# EAGLE schematic GND_SATION_PCB_1.02 (EAGLE 9.6.2)
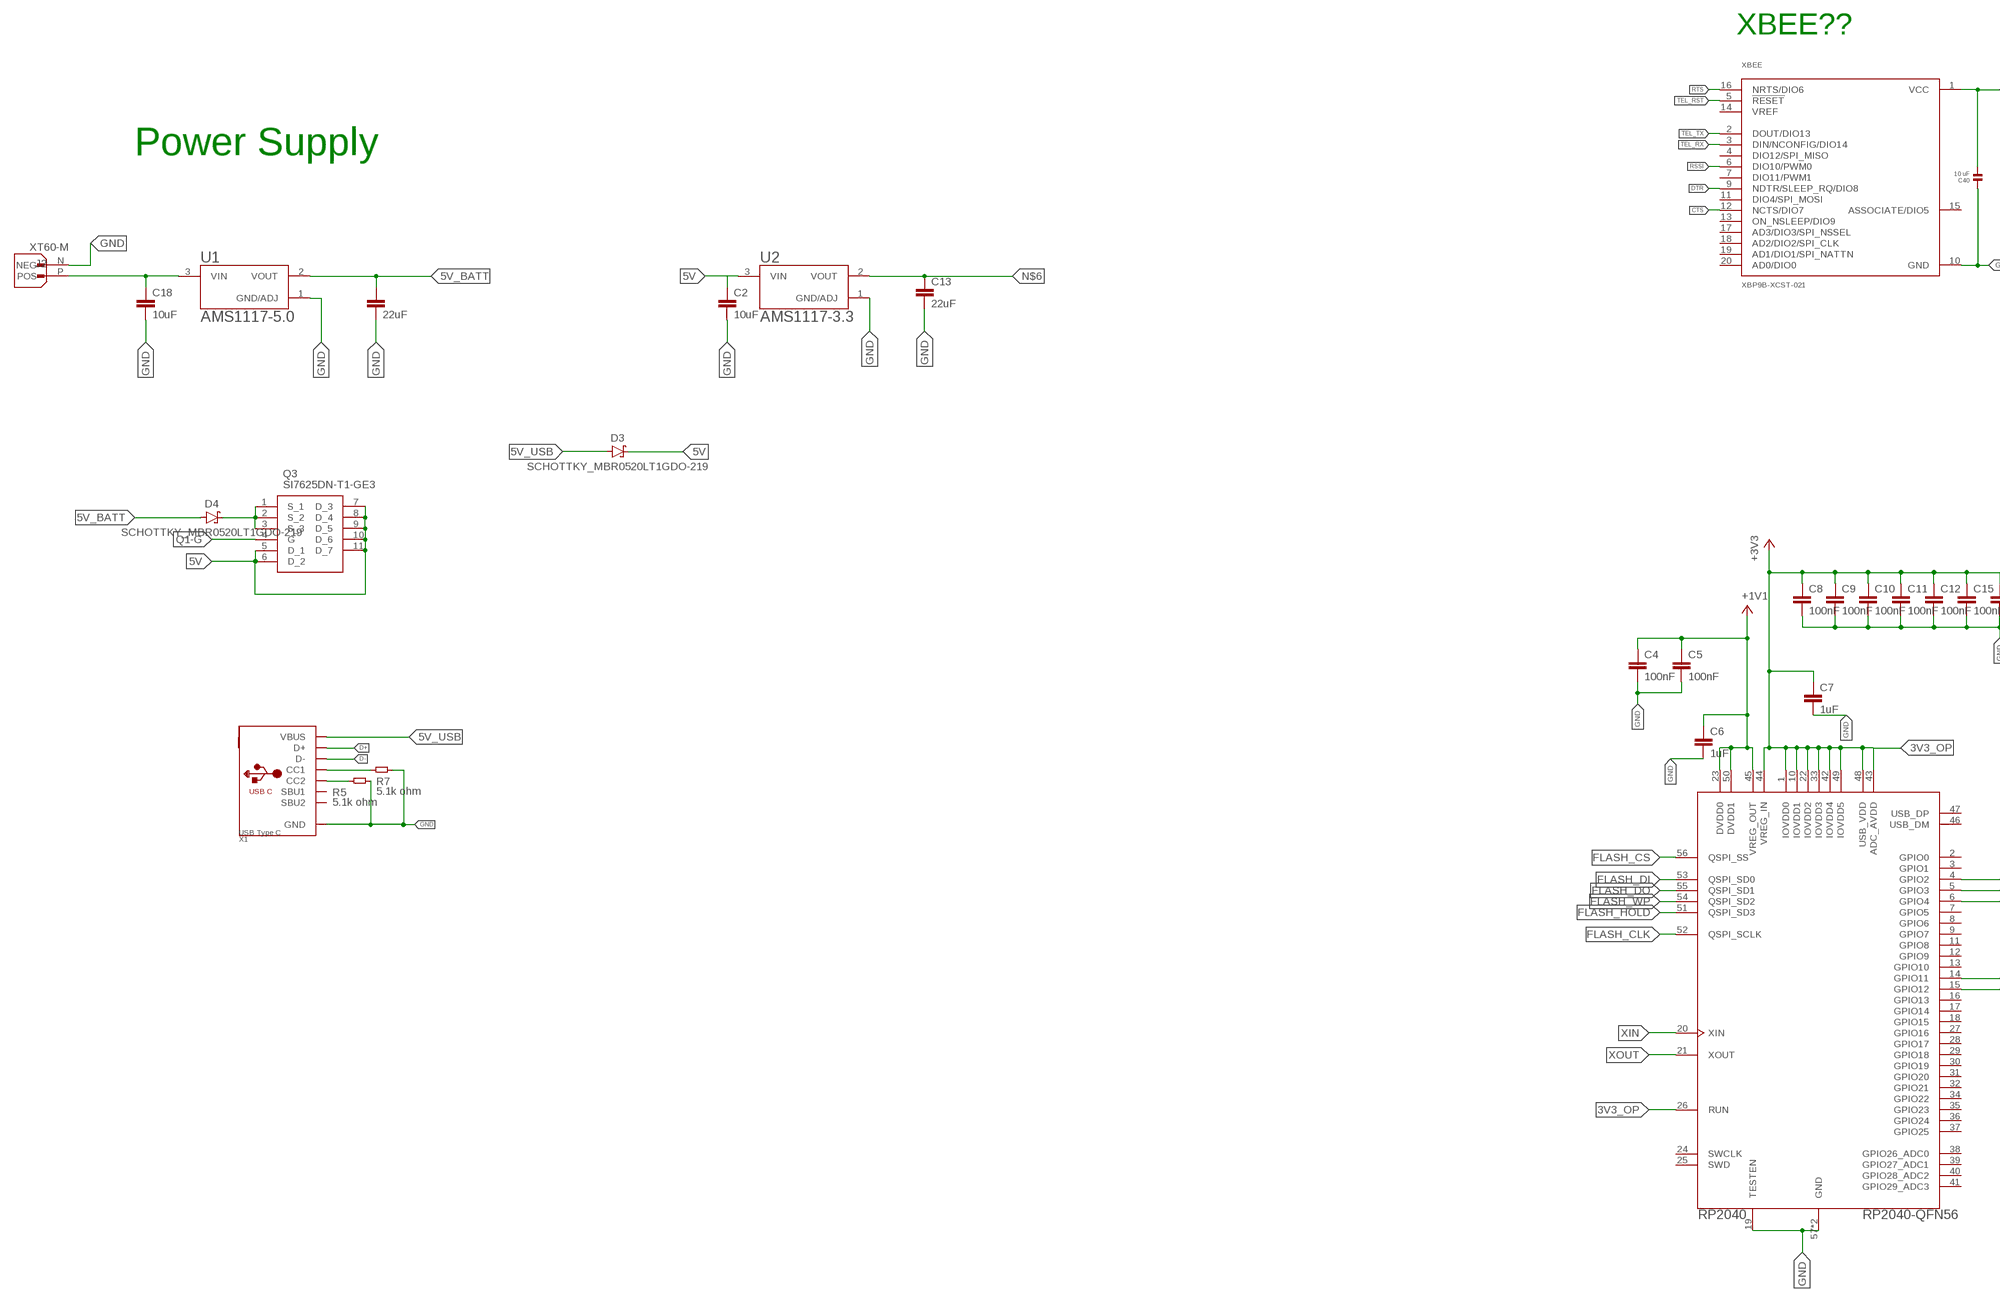
[diagram p0: schematic, sheet 1, part 1 of 2]
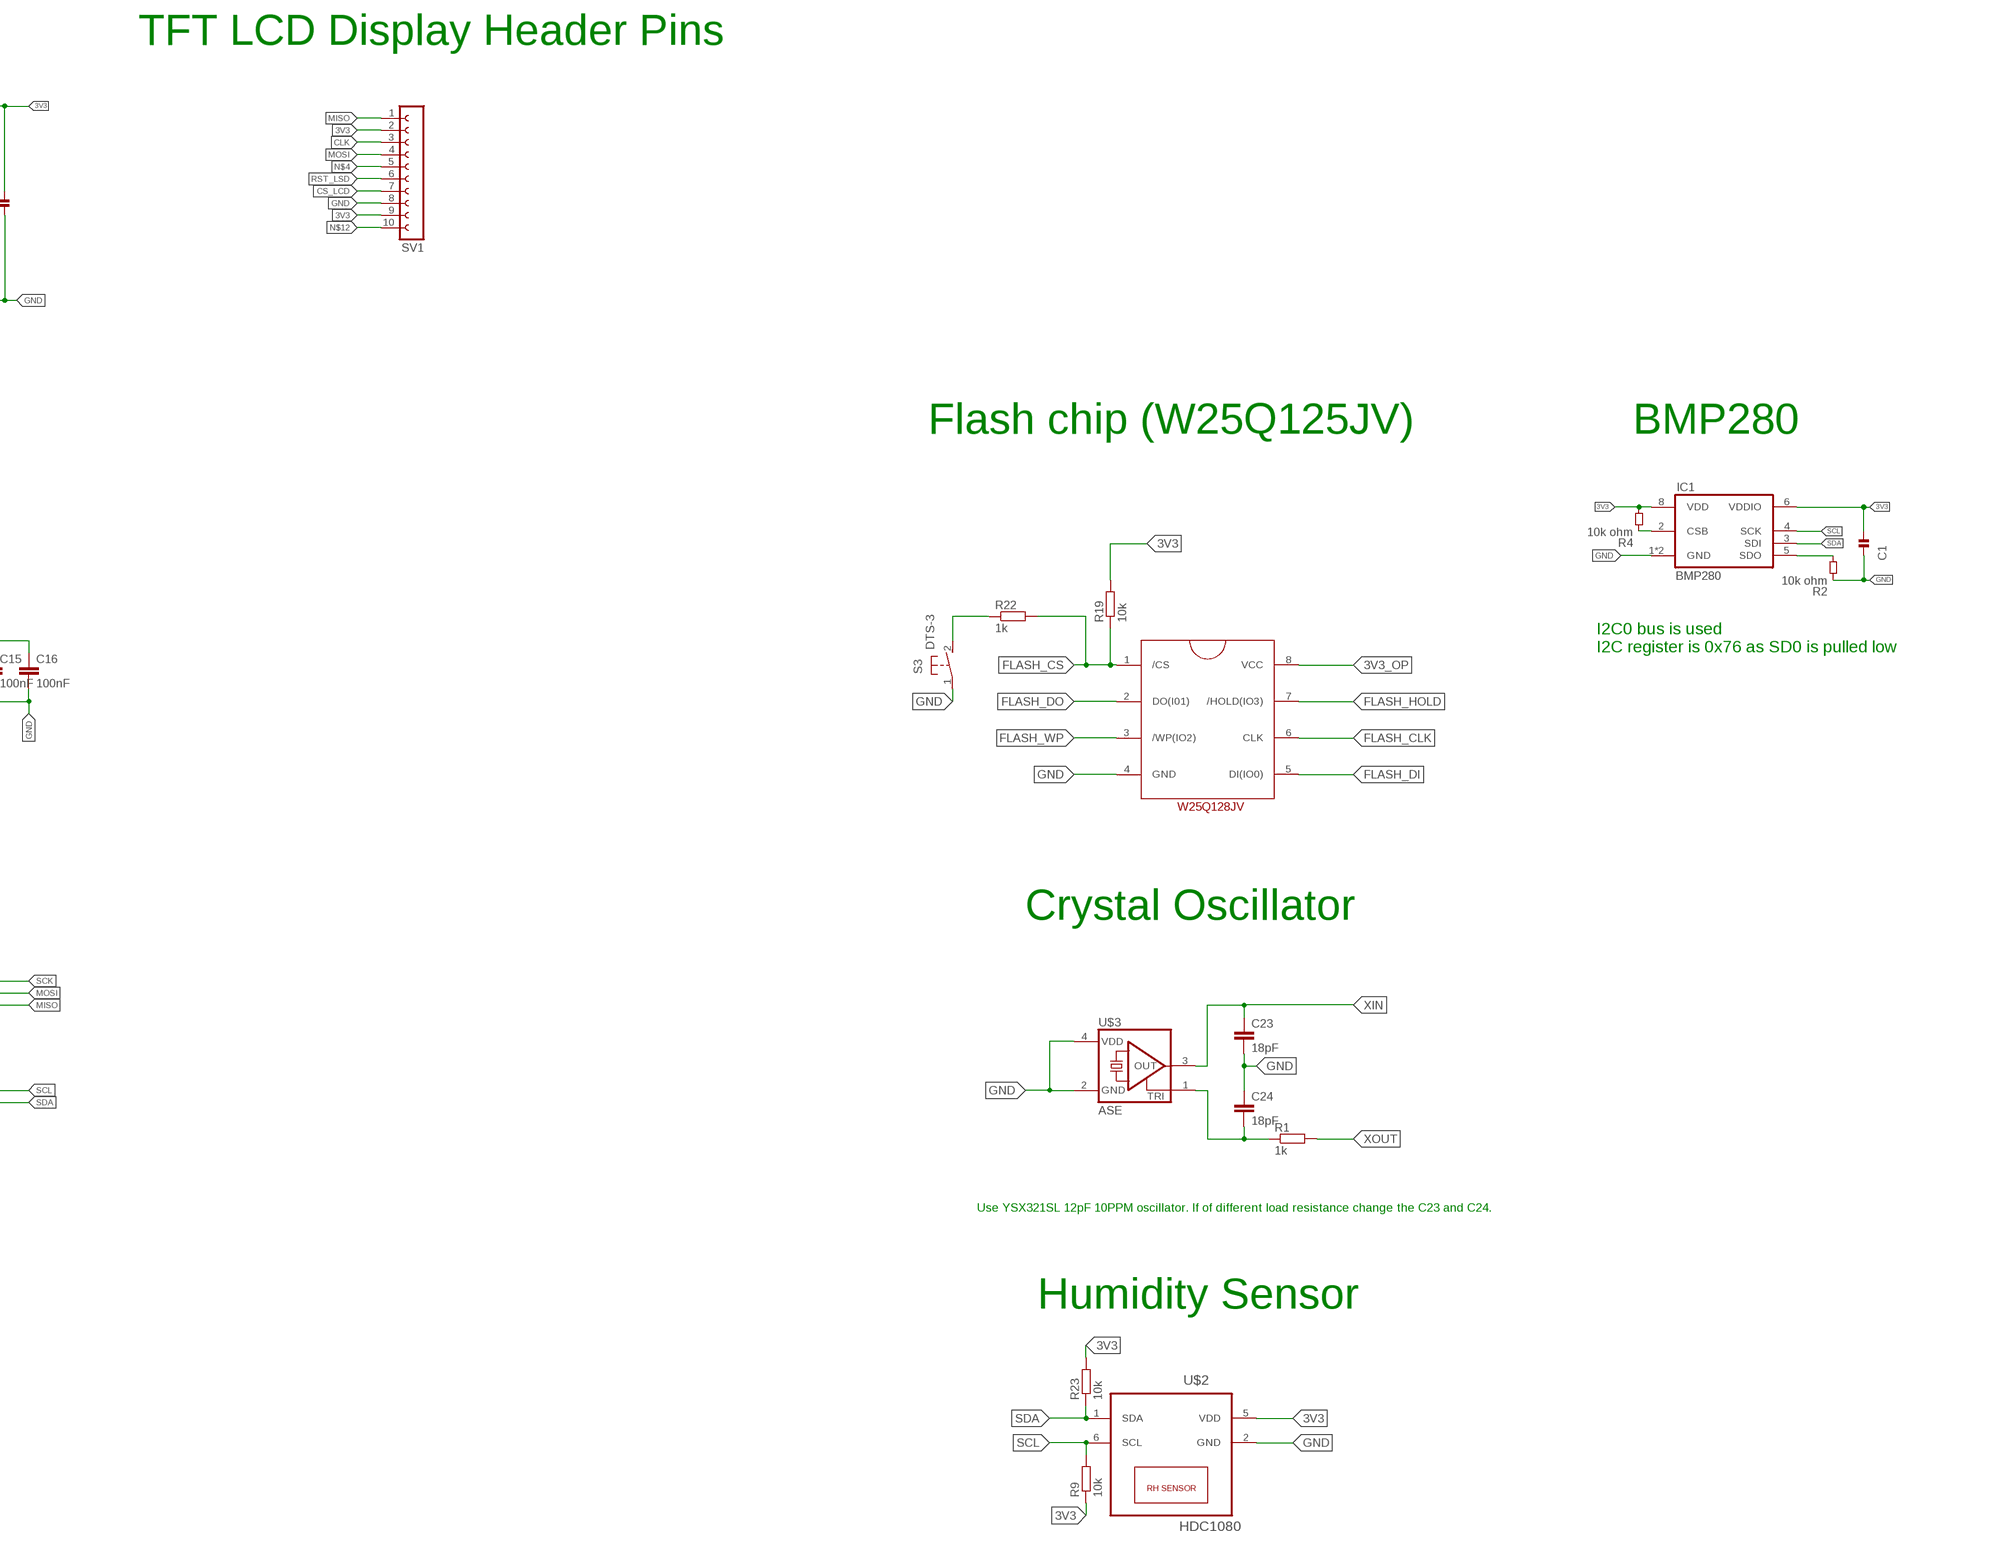
[diagram p1: schematic, sheet 1, part 2 of 2]

## Parts
C1  10 uF  CAPACITOR.0603  [0603]
C2  10uF  C-EUC0805  [C0805]
C3  22uF  C-EUC0805  [C0805]
C4  100nF  C-EUC0603  [C0603]
C5  100nF  C-EUC0603  [C0603]
C6  1uF  C-EUC0603  [C0603]
C7  1uF  C-EUC0603  [C0603]
C8  100nF  C-EUC0603  [C0603]
C9  100nF  C-EUC0603  [C0603]
C10  100nF  C-EUC0603  [C0603]
C11  100nF  C-EUC0603  [C0603]
C12  100nF  C-EUC0603  [C0603]
C13  22uF  C-EUC0805  [C0805]
C15  100nF  C-EUC0603  [C0603]
C16  100nF  C-EUC0603  [C0603]
C18  10uF  C-EUC0805  [C0805]
C23  18pF  C-EUC0805  [C0805]
C24  18pF  C-EUC0805  [C0805]
C40  10 uF  CAPACITOR.0603  [0603]
D3  SCHOTTKY_MBR0520LT1GDO-219  [SODFL3718X115]
D4  SCHOTTKY_MBR0520LT1GDO-219  [SODFL3718X115]
IC1  BMP280  [BMP280]
J2  XT60-M  [AMASS_XT60-M]
Q3  SI7625DN-T1-GE3  [SIS862DNT1GE3]
R1  1k  R-EU_R0805  [R0805]
R2  10k ohm  RESISTOR.0603  [0603]
R4  10k ohm  RESISTOR.0603  [0603]
R5  5.1k ohm  RESISTOR.0603  [0603]
R7  5.1k ohm  RESISTOR.0603  [0603]
R9  10k  R-EU_R0805  [R0805]
R19  10k  R-EU_R0805  [R0805]
R22  1k  R-EU_R0805  [R0805]
R23  10k  R-EU_R0805  [R0805]
RP2040  RP2040-QFN56  [RP2040-QFN-56]
S3  DTS-3  [DTS-3]
SV1  FE10-1  [FE10]
U1  AMS1117-5.0  [SOT229P700X180-4N]
U2  AMS1117-3.3  [SOT229P700X180-4N]
U4  SOIC127P790X216-8NW25Q128JVJSQ  [SOIC127P790X216-8N]
U$2  HDC1080  [TI-S-PWSON-N6]
U$3  ASE  [ASE]
X1  USB Type C  USB_C  [USB_C_CUSB31-CFM2AX-01-X]
XBEE  XBP9B-XCST-021  [DIP2200W51P200L3294H279Q20P]

## Nets
1V1: C4.1 C5.1 C6.1 RP2040.23(DVDD0) RP2040.45(VREG_OUT) RP2040.50(DVDD1) ; supply symbol labelled +1V1
3V3: C1.2 C40.2 IC1.6(VDDIO) IC1.8(VDD) R4.2 R9.1 R19.2 R23.2 SV1.2 SV1.9 U$2.5(VDD) XBEE.1(VCC)
3V3_OP: C7.1 C8.1 C9.1 C10.1 C11.1 C12.1 C15.1 C16.1 RP2040.1(IOVDD0) RP2040.10(IOVDD1) RP2040.22(IOVDD2) RP2040.26(RUN) RP2040.33(IOVDD3) RP2040.42(IOVDD4) RP2040.43(ADC_AVDD) RP2040.44(VREG_IN) RP2040.48(USB_VDD) RP2040.49(IOVDD5) U4.8(VCC) ; supply symbol labelled +3V3
5V: D3.1(C) Q3.5(D_1) Q3.6(D_2) Q3.7(D_3) Q3.8(D_4) Q3.9(D_5) Q3.10(D_6) Q3.11(D_7) U2.3(VIN)
5V_BATT: C3.1 D4.1(C) Q3.1(S_1) Q3.2(S_2) Q3.3(S_3) U1.2(VOUT)
5V_USB: D3.2(A) X1.A4B9(VBUS) X1.B4A9(VBUS)
CC3: R5.1 X1.B5(CC2)
CC4: R7.1 X1.A5(CC1)
CLK: SV1.3
CS_LCD: SV1.7
CSB: IC1.2(CSB) R4.1
CTS: XBEE.12(NCTS/DIO7)
D+: X1.A6(D+) X1.B6(D+)
D-: X1.A7(D-) X1.B7(D-)
DTR: XBEE.9(NDTR/SLEEP_RQ/DIO8)
FLASH_CLK: RP2040.52(QSPI_SCLK) U4.6(CLK)
FLASH_CS: R19.1 R22.2 RP2040.56(QSPI_SS) U4.1(/CS)
FLASH_DI: RP2040.53(QSPI_SD0) U4.5(DI(IO0))
FLASH_DO: RP2040.55(QSPI_SD1) U4.2(DO(I01))
FLASH_HOLD: RP2040.51(QSPI_SD3) U4.7(/HOLD(IO3))
FLASH_WP: RP2040.54(QSPI_SD2) U4.3(/WP(IO2))
GND: C1.1 C2.2 C3.2 C4.2 C5.2 C6.2 C7.2 C8.2 C9.2 C10.2 C11.2 C12.2 C13.2 C15.2 C16.2 C18.2 C23.2 C24.1 C40.1 IC1.1(GND) IC1.7(GND) J2.N(NEG) R2.1 R5.2 R7.2 RP2040.19(TESTEN) RP2040.57(GND) RP2040.62(GND) S3.1 SV1.8 U1.1(GND/ADJ) U2.1(GND/ADJ) U4.4(GND) U$2.2(GND) U$3.2(GND) U$3.4(VDD) X1.A1B12(GND) X1.B1A12(GND) XBEE.10(GND)
MISO: RP2040.6(GPIO4) SV1.1
MOSI: RP2040.5(GPIO3) SV1.4
N$1: D4.2(A)
N$2: R22.1 S3.2
N$3: C2.1
N$4: SV1.5
N$6: C13.1 U2.2(VOUT)
N$12: SV1.10
N$16: C18.1 J2.P(POS) U1.3(VIN)
Q1-G: Q3.4(G)
RSSI: XBEE.6(DIO10/PWM0)
RST_LSD: SV1.6
RTS: XBEE.16(NRTS/DIO6)
SCK: RP2040.4(GPIO2)
SCL: IC1.4(SCK) R9.2 RP2040.14(GPIO11) U$2.6(SCL)
SDA: IC1.3(SDI) R23.1 RP2040.15(GPIO12) U$2.1(SDA)
SDO1: IC1.5(SDO) R2.2
TEL_RST: XBEE.5(!RESET)
TEL_RX: XBEE.3(DIN/NCONFIG/DIO14)
TEL_TX: XBEE.2(DOUT/DIO13)
XIN: C23.1 RP2040.20(XIN) U$3.3(OUT)
XOUT: C24.2 R1.1 R1.2 RP2040.21(XOUT) U$3.1(TRI)
Unconnected: RP2040.2(GPIO0) RP2040.3(GPIO1) RP2040.7(GPIO5) RP2040.8(GPIO6) RP2040.9(GPIO7) RP2040.11(GPIO8) RP2040.12(GPIO9) RP2040.13(GPIO10) RP2040.16(GPIO13) RP2040.17(GPIO14) RP2040.18(GPIO15) RP2040.24(SWCLK) RP2040.25(SWD) RP2040.27(GPIO16) RP2040.28(GPIO17) RP2040.29(GPIO18) RP2040.30(GPIO19) RP2040.31(GPIO20) RP2040.32(GPIO21) RP2040.34(GPIO22) RP2040.35(GPIO23) RP2040.36(GPIO24) RP2040.37(GPIO25) RP2040.38(GPIO26_ADC0) RP2040.39(GPIO27_ADC1) RP2040.40(GPIO28_ADC2) RP2040.41(GPIO29_ADC3) RP2040.46(USB_DM) RP2040.47(USB_DP) X1.A8(SBU1) X1.B8(SBU2) XBEE.4(DIO12/SPI_MISO) XBEE.7(DIO11/PWM1) XBEE.11(DIO4/SPI_MOSI) XBEE.13(ON_NSLEEP/DIO9) XBEE.14(VREF) XBEE.15(ASSOCIATE/DIO5) XBEE.17(AD3/DIO3/SPI_NSSEL) XBEE.18(AD2/DIO2/SPI_CLK) XBEE.19(AD1/DIO1/SPI_NATTN) XBEE.20(AD0/DIO0)

## Notes on the sheet
- XBEE?? | TFT LCD Display Header Pins
- Power Supply
- Flash chip (W25Q125JV) | BMP280
- I2C0 bus is used
  I2C register is 0x76 as SD0 is pulled low
- Crystal Oscillator
- Use YSX321SL 12pF 10PPM oscillator. If of different load resistance change the C23 and C24.
- Humidity Sensor

## Library data of the parts
C1 C40 = standardparts:CAPACITOR
C2-C13 C15 C16 C18 C23 C24 = rcl:C-EU: CAPACITOR, European symbol; SPICEPREFIX: C
D3 D4 = Diode:SCHOTTKY_: Schottky Diode - Popular parts; CATEGORY: Diode; DATASHEET: https://www.onsemi.com/download/data-sheet/pdf/mbr0520lt1-d.pdf; DESCRIPTION: Diode 20 V 500mA Surface Mount SOD-123; FORWARD_CURRENT: 500mA; FORWARD_VOLTAGE: 385mV; MANUFACTURER: onsemi; MPN: MBR0520LT1G; OPERATING_TEMPERATURE: -65°C ~ 125°C; PACKAGE_SIZE: SOD-123; PACKAGE_TYPE: SMD; PART_STATUS: ACTIVE; REVERSE_VOLTAGE: 20V; ROHS: COMPLIANT; SERIES: MBR0520; SUBCATEGORY: Schottky Diodes; TYPE: Schottky Power Rectifier; ZENER_VOLTAGE: NA
IC1 = BMP280-standalone:BMP280: The BMP280 is an absolute barometric pressure sensor especially designed for mobile applications. The sensor module is housed in an extremely compact 8-pin metal-lid LGA package with a footprint of only 2.0 × 2.5 mm2 and 0.95 mm package height. Its small dimensions and its low power consumption of 2.7 μA @1Hz allow the implementation in battery driven devices such as mobile phones, GPS modules or watches. The library has been designed by Richard Magdycz <https://www.facebook.com/groups/eaglecadsoftUK>
J2 = XT60-M:XT60-M: Check availability <https://pricing.snapeda.com/parts/XT60-M/AMASS/view-part?ref=eda>; AVAILABILITY: Not in stock; CHECK_PRICES: https://www.snapeda.com/parts/XT60-M/AMASS/view-part/?ref=eda; DESCRIPTION: Plug; DC supply; XT60; male; PIN: 2; for cable; soldered; 30A; 500V; MF: AMASS; MP: XT60-M; PACKAGE: Package; PRICE: None; SNAPEDA_LINK: https://www.snapeda.com/parts/XT60-M/AMASS/view-part/?ref=snap
Q3 = SI7625DN-T1-GE3:SI7625DN-T1-GE3: VISHAY - SI7625DN-T1-GE3 - MOSFET, P CHANNEL, -30V, -35A, POWERPAK 1212-8 Source: Datasheet <https://www.vishay.com/docs/65737/si7625dn.pdf>; DESCRIPTION: VISHAY - SI7625DN-T1-GE3 - MOSFET, P CHANNEL, -30V, -35A, POWERPAK 1212-8; HEIGHT: 1.12mm; MANUFACTURER_NAME: Vishay; MANUFACTURER_PART_NUMBER: SI7625DN-T1-GE3
R1 R9 R19 R22 R23 = rcl:R-EU_: RESISTOR, European symbol; SPICEPREFIX: R
R2 R4 R5 R7 = standardparts:RESISTOR
RP2040 = RpiPico:RP2040-QFN56
S3 = DTS-3:DTS-3: Check availability <https://pricing.snapeda.com/parts/DTS-3/APEM%20Inc./view-part?ref=eda>; AVAILABILITY: Not in stock; CHECK_PRICES: https://www.snapeda.com/parts/DTS-3/APEM/view-part/?ref=eda; DESCRIPTION: Tactile Switch SPST-NO Top Actuated Through Hole; MF: APEM Inc.; MP: DTS-3; PACKAGE: DIP-10 APEM Inc.; PRICE: None; SNAPEDA_LINK: https://www.snapeda.com/parts/DTS-3/APEM/view-part/?ref=snap
SV1 = con-lsta:FE10-1: FEMALE HEADER; OC_FARNELL: unknown; OC_NEWARK: unknown
U1 = AMS1117-5.0:AMS1117-5.0: Check availability <https://pricing.snapeda.com/parts/AMS1117-5.0/Advanced%20Monolithic%20Systems/view-part?ref=eda>; AVAILABILITY: Not in stock; CHECK_PRICES: https://www.snapeda.com/parts/AMS1117-5.0/Advanced+Monolithic+Systems/view-part/?ref=eda; DESCRIPTION: Sot223/Pkg 1-Amp 5-Volt Low Drop Out Voltage Regulatator; MF: Advanced Monolithic Systems; MP: AMS1117-5.0; PACKAGE: SOT-223 Seeed Technology; PRICE: None; SNAPEDA_LINK: https://www.snapeda.com/parts/AMS1117-5.0/Advanced+Monolithic+Systems/view-part/?ref=snap
U2 = AMS1117-3.3:AMS1117-3.3: Check availability <https://pricing.snapeda.com/parts/AMS1117-3.3/Advanced%20Monolithic%20Systems/view-part?ref=eda>; AVAILABILITY: Not in stock; CHECK_PRICES: https://www.snapeda.com/parts/AMS1117-3.3/Advanced+Monolithic+Systems/view-part/?ref=eda; DESCRIPTION: Sot223/Pkg 1-Amp 3.3-Volt Low Drop Out Voltage Regulatator; MF: Advanced Monolithic Systems; MP: AMS1117-3.3; PACKAGE: SOT-223 Seeed Technology; PRICE: None; SNAPEDA_LINK: https://www.snapeda.com/parts/AMS1117-3.3/Advanced+Monolithic+Systems/view-part/?ref=snap
U4 = SOIC127P790X216-8N:SOIC127P790X216-8N
U$2 = Texas-HDC1080:HDC1080
U$3 = crystal:ASE: 3.3Vdc CMOS SMD CRYSTAL CLOCK OSCILLATOR SOurce: www.abracon.com; OC_FARNELL: unknown; OC_NEWARK: unknown
X1 = microbuilder:USB_C: USB Type-C USB 2.0 Connector
XBEE = XBP9B-XCST-021:XBP9B-XCST-021: XBee-PRO 900HP DigiMesh 900 MHz 200 Kbps RF Module with U.FL Connector Check availability <https://pricing.snapeda.com/parts/XBP9B-XCST-021/Digi%20International/view-part?ref=eda>; AVAILABILITY: In Stock; CHECK_PRICES: https://www.snapeda.com/parts/XBP9B-XCST-021/Digi+International/view-part/?ref=eda; DESCRIPTION: General ISM < 1GHz - Transceiver Module 920MHz Antenna Not Included, RP-SMA Through Hole; MF: Digi International; MP: XBP9B-XCST-021; PACKAGE: Module Digi International; PRICE: None; PURCHASE-URL: https://www.snapeda.com/api/url_track_click_mouser/?unipart_id=521579&manufacturer=Digi International&part_name=XBP9B-XCST-021&search_term=None; SNAPEDA_LINK: https://www.snapeda.com/parts/XBP9B-XCST-021/Digi+International/view-part/?ref=snap